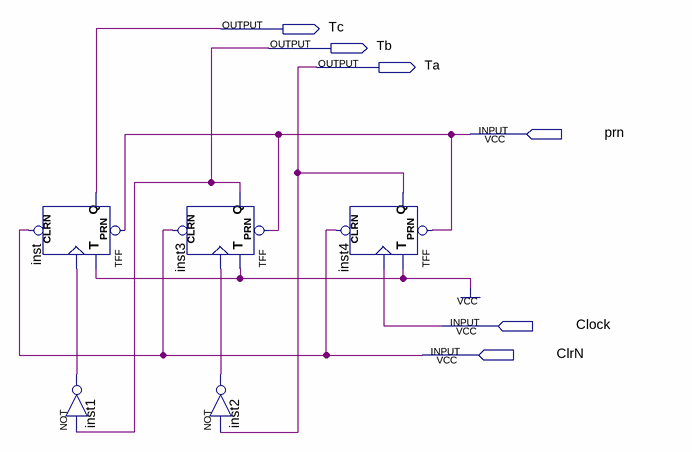
[diagram p0: schematic sheet]
// Quartus schematic TFFU.bdf as structural Verilog: 5 symbols, 6 pins
module TFFU (
  input  prn,
  input  Clock,
  input  ClrN,
  output Tc,
  output Tb,
  output Ta
);

  wire inst1_out, inst2_out;

  TFF inst (.PRN(prn), .CLRN(ClrN), .T(1'b1), .CLK(inst1_out), .Q(Tc));
  not inst1 (inst1_out, Tb);
  TFF inst3 (.PRN(prn), .CLRN(ClrN), .T(1'b1), .CLK(inst2_out), .Q(Tb));
  not inst2 (inst2_out, Ta);
  TFF inst4 (.PRN(prn), .CLRN(ClrN), .T(1'b1), .CLK(Clock), .Q(Ta));
endmodule
